# Altium project 期中.PrjPCB
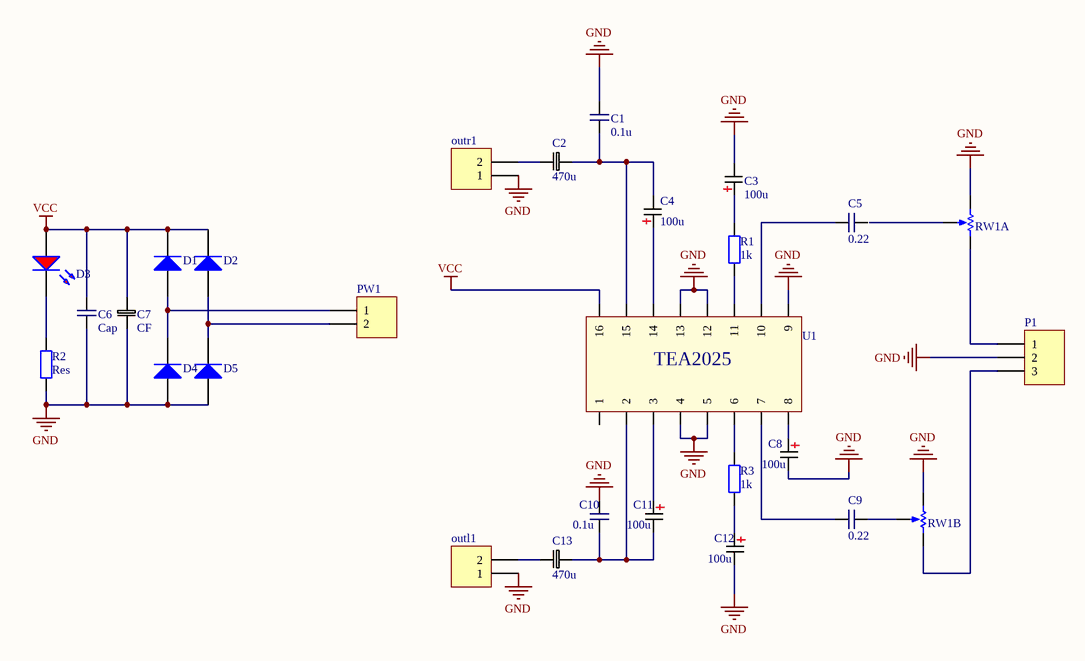
[diagram p0: 原理图.SchDoc]
1 sheet, 27 parts. Net scope: global (net labels, ports and power ports of the same name join across sheets).
Board file: PCB.PcbDoc

## Sheet 原理图.SchDoc
size A4

### Parts
C1  0.1u  [RAD0.1]
C2  470u  [CF0.1-6.5]
C3  100u  [CF0.1]
C4  100u  [CF0.1]
C5  0.22  [RAD0.1]
C6  Cap  [RAD0.1]
C7  CF  [CF0.2-13]
C8  100u  [CF0.2-13]
C9  0.22  [RAD0.1]
C10  0.1u  [RAD0.1]
C11  100u  [CF0.1]
C12  100u  [CF0.1]
C13  470u  [CF0.1-6.5]
D1  Diode 1N4007  [DIO10.46-5.3x2.8]  (value not drawn)
D2  Diode 1N4007  [DIO10.46-5.3x2.8]  (value not drawn)
D3  LED0  [LED]  (value not drawn)
D4  Diode 1N4007  [DIO10.46-5.3x2.8]  (value not drawn)
D5  Diode 1N4007  [DIO10.46-5.3x2.8]  (value not drawn)
outl1  Header 2  [HDR1X2]  (value not drawn)
outr1  Header 2  [HDR1X2]  (value not drawn)
P1  Header 3  [HDR1X3]  (value not drawn)
PW1  Header 2  [HDR1X2]  (value not drawn)
R1  1k  [RAD0.1]
R2  Res  [AXIAL-0.3]
R3  1k  [RAD0.1]
RW1  RW  [RW]  (value not drawn)  (parts A,B of 2)
U1  TEA2025  [DIP16]  (value not drawn)

### Nets
GND: C1.1 C3.2 C6.1 C7.2 C8.2 C10.1 C12.2 D4.1(A) D5.1(A) outl1.1 outr1.1 P1.2 R2.1 RW1.1(TOP) RW1.4(TOP) U1.4 U1.5 U1.9 U1.12 U1.13
VCC: C6.2 C7.1 D1.2(K) D2.2(K) D3.1(A) U1.16
NetC1_2: C1.2 C2.1 C4.2 U1.15
NetC2_2: C2.2 outr1.2
NetC3_1: C3.1 R1.1
NetC4_1: C4.1 U1.14
NetC5_1: C5.1 U1.10
NetC8_1: C8.1 U1.8
NetC9_1: C9.1 U1.7
NetC9_2: C9.2 RW1.5(TAP)
NetC10_2: C10.2 C11.2 C13.1 U1.2
NetC11_1: C11.1 U1.3
NetC12_1: C12.1 R3.1
NetC13_2: C13.2 outl1.2
NetD1_1: D1.1(A) D4.2(K) PW1.1
NetD2_1: D2.1(A) D5.2(K) PW1.2
NetD3_2: D3.2(K) R2.2
NetP1_1: P1.1 RW1.3(BOT)
NetP1_3: P1.3 RW1.6(BOT)
NetR1_2: R1.2 U1.11
NetR3_2: R3.2 U1.6

Not connected (* = marked no-connect by the designer): C5 2; RW1 2(TAP); U1 1

### Library data of the parts
C1 C5 C9 C10 = Cap
C2 C13 = CF
C3 C4 C8 C11 C12 = Cap Pol
D1 D2 D4 D5 = Diode 1N4007: 1 Amp General Purpose Rectifier; Published: 8-Jun-2000; LatestRevisionDate: 17-Jul-2002; LatestRevisionNote: Re-released for DXP Platform.; DatasheetVersion: 1998; PackageVersion: Aug-1999; PackageReference: DO-41; Publisher: Altium Limited; Code_JEDEC: DO-204-AL; ComponentLink1Description: Manufacturer Link; ComponentLink1URL: http://www.fairchildsemi.com/; ComponentLink2Description: Datasheet; ComponentLink2URL: http://www.fairchildsemi.com/ds/1N%2F1N4001.pdf
outl1 outr1 PW1 = Header 2: Header, 2-Pin; LatestRevisionDate: 17-Jul-2002; LatestRevisionNote: Re-released for DXP Platform.; Publisher: Altium Limited
P1 = Header 3: Header, 3-Pin; LatestRevisionDate: 17-Jul-2002; LatestRevisionNote: Re-released for DXP Platform.; Publisher: Altium Limited
R1 R3 = Res: Resistor; Published: 8-Jun-2000; LatestRevisionDate: 17-Jul-2002; LatestRevisionNote: Re-released for DXP Platform.; PackageReference: AXIAL-0.4; Publisher: Altium Limited; Value: 1K
R2 = Res: Resistor; Value: 1K; Published: 8-Jun-2000; LatestRevisionDate: 17-Jul-2002; LatestRevisionNote: Re-released for DXP Platform.; PackageReference: AXIAL-0.4; Publisher: Altium Limited
D3 = LED0: Published: 8-Jun-2000; LatestRevisionDate: 08-Jul-2005; LatestRevisionNote: Mech Layer 1 removed.; PackageReference: LED-0; Publisher: Altium Limited